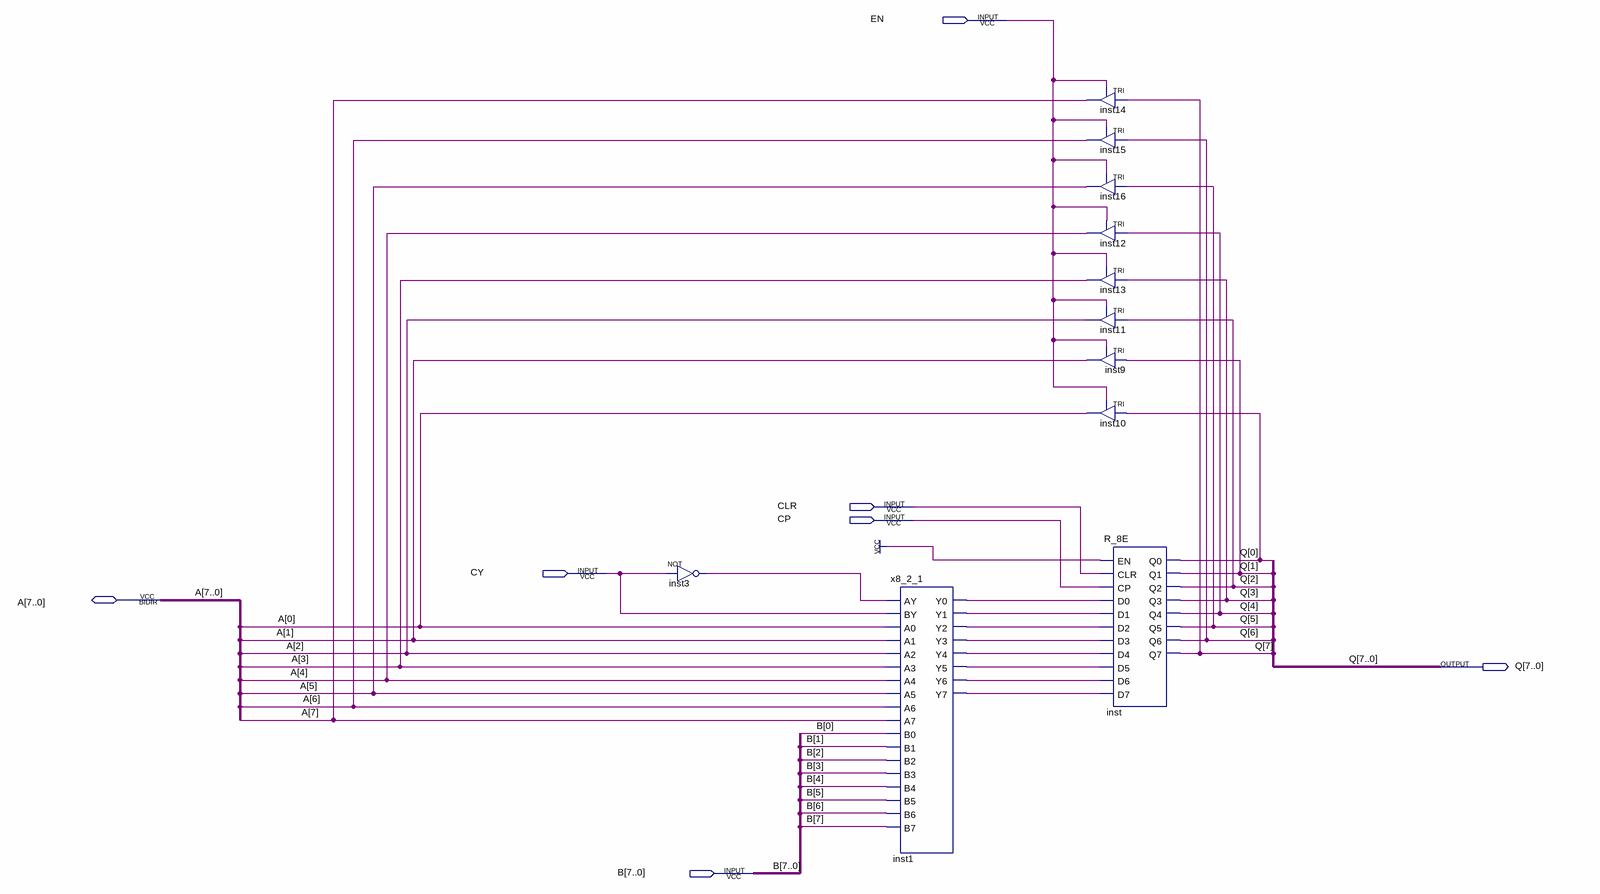
[diagram p0: schematic sheet]
// Quartus schematic MDR.bdf as structural Verilog: 11 symbols, 7 pins
module MDR (
  input  EN,
  input  CLR,
  input  CP,
  input  CY,
  input  [7:0] B,
  inout  [7:0] A,
  output [7:0] Q
);

  wire inst1_y0, inst1_y1, inst1_y2, inst1_y3, inst1_y4, inst1_y5, inst1_y6, inst1_y7, inst3_out;

  not inst3 (inst3_out, CY);
  x8_2_1 inst1 (
    .AY(inst3_out), .BY(CY), .A0(A[0]), .A1(A[1]), .A2(A[2]), .A3(A[3]), .A4(A[4]), .A5(A[5]), .A6(A[6]),
    .A7(A[7]), .B0(B[0]), .B1(B[1]), .B2(B[2]), .B3(B[3]), .B4(B[4]), .B5(B[5]), .B6(B[6]), .B7(B[7]),
    .Y0(inst1_y0), .Y1(inst1_y1), .Y2(inst1_y2), .Y3(inst1_y3), .Y4(inst1_y4), .Y5(inst1_y5), .Y6(inst1_y6),
    .Y7(inst1_y7));
  TRI inst14 (.IN(Q[7]), .OE(EN), .OUT(A[7]));
  TRI inst15 (.IN(Q[6]), .OE(EN), .OUT(A[6]));
  TRI inst16 (.IN(Q[5]), .OE(EN), .OUT(A[5]));
  TRI inst12 (.IN(Q[4]), .OE(EN), .OUT(A[4]));
  TRI inst13 (.IN(Q[3]), .OE(EN), .OUT(A[3]));
  TRI inst11 (.IN(Q[2]), .OE(EN), .OUT(A[2]));
  TRI inst9 (.IN(Q[1]), .OE(EN), .OUT(A[1]));
  TRI inst10 (.IN(Q[0]), .OE(EN), .OUT(A[0]));
  R_8E inst (
    .EN(1'b1), .CLR(CLR), .CP(CP), .D0(inst1_y0), .D1(inst1_y1), .D2(inst1_y2), .D3(inst1_y3), .D4(inst1_y4),
    .D5(inst1_y5), .D6(inst1_y6), .D7(inst1_y7), .Q0(Q[0]), .Q1(Q[1]), .Q2(Q[2]), .Q3(Q[3]), .Q4(Q[4]),
    .Q5(Q[5]), .Q6(Q[6]), .Q7(Q[7]));
endmodule
